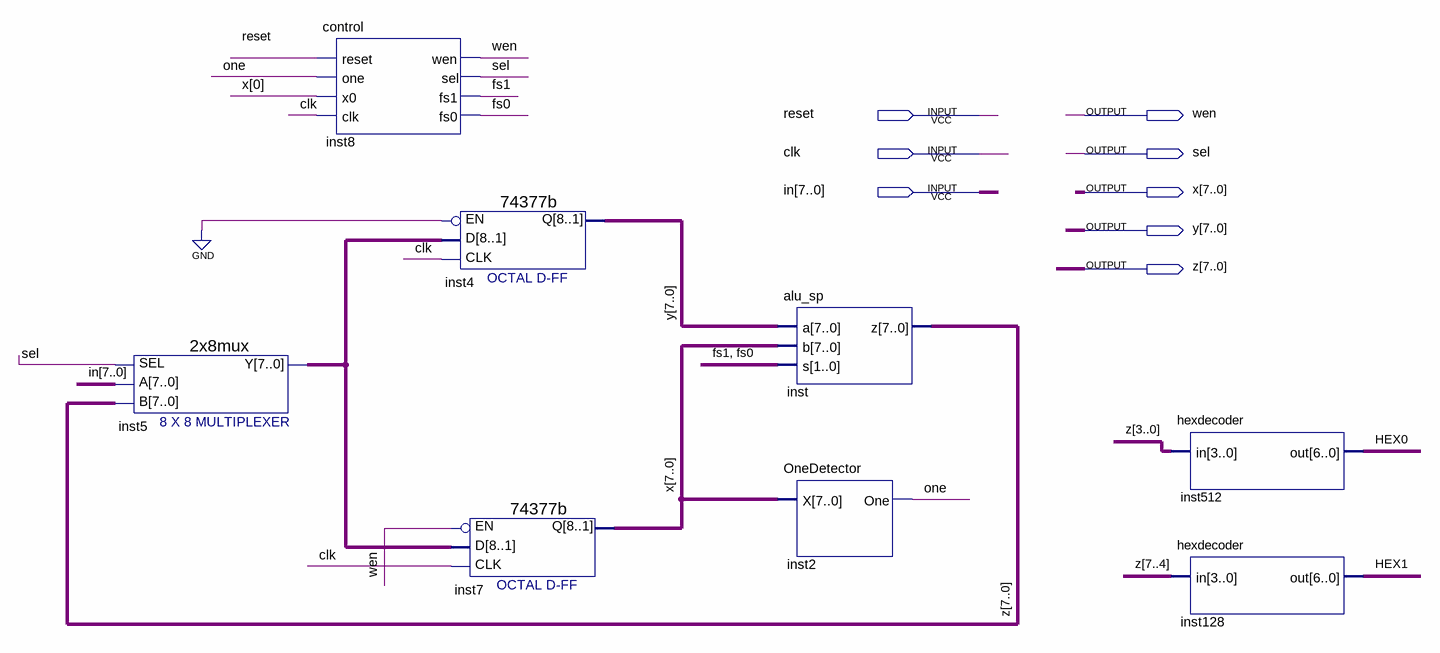
[diagram p0: schematic sheet]
// Quartus schematic statemachine.bdf as structural Verilog: 8 symbols, 8 pins
module statemachine (
  input  reset,
  input  clk,
  input  [7:0] in,
  output wen,
  output sel,
  output [7:0] x,
  output [7:0] y,
  output [7:0] z
);

  wire fs0, fs1, HEX0, HEX1, one;
  wire [7:0] inst5_y;

  \2x8mux  inst5 (.SEL(sel), .A(in), .B(z), .Y(inst5_y));
  control inst8 (.reset(reset), .one(one), .x0(x[0]), .clk(clk), .wen(wen), .sel(sel), .fs1(fs1), .fs0(fs0));
  \74377b  inst4 (.CLK(clk), .EN(1'b0), .D(inst5_y), .Q(y));
  \74377b  inst7 (.CLK(clk), .EN(wen), .D(inst5_y), .Q(x));
  alu_sp inst (.a(y), .b(x), .s({fs1, fs0}), .z(z));
  OneDetector inst2 (.X(x), .One(one));
  hexdecoder inst512 (.in(z[3:0]), .out(HEX0));
  hexdecoder inst128 (.in(z[7:4]), .out(HEX1));
endmodule
